# Altium project practice1.PrjPcb
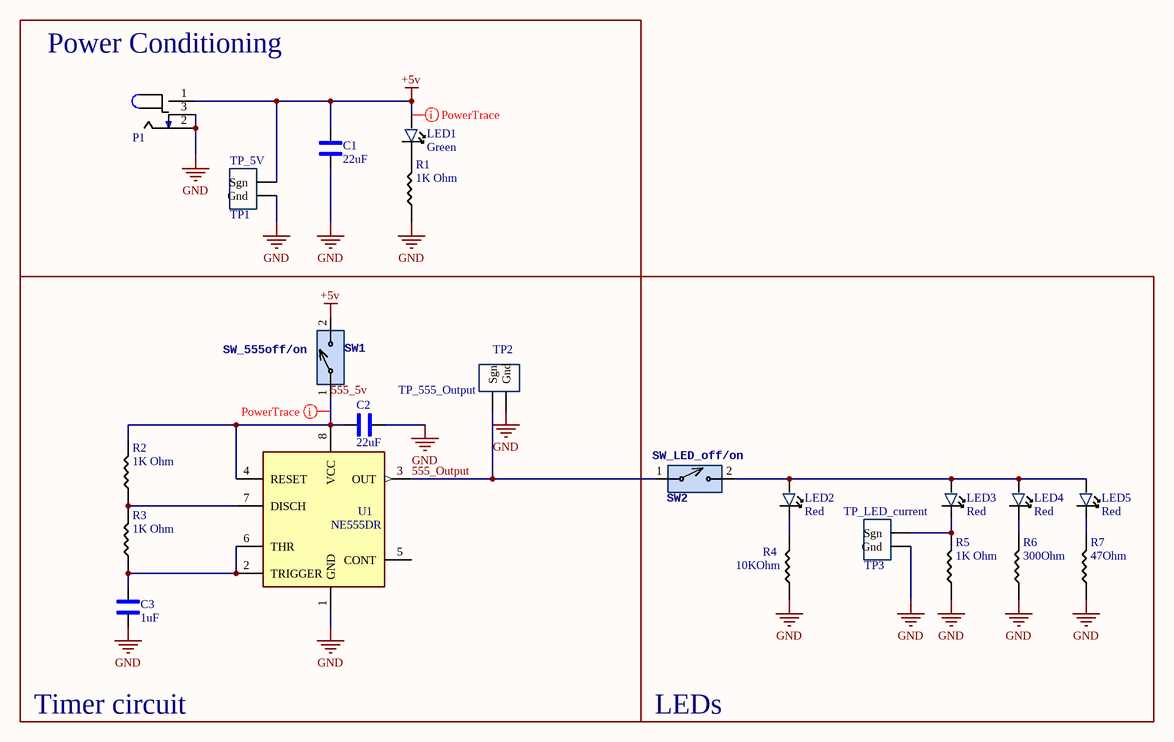
[diagram p0: Sheet1.SchDoc]
1 sheet, 22 parts. Net scope: global (net labels, ports and power ports of the same name join across sheets).
Board file: ECEN5730_brd1a_2022-15-01.PcbDoc

## Sheet Sheet1.SchDoc: Practice Board
size A4; DrawnBy: Rajat Chaple; Revision: 0.0.1; SheetNumber: 1; SheetTotal: 1

### Parts
C1  22uF  [1206_Passive_Capacitor]
C2  22uF  [1206_Passive_Capacitor]
C3  1uF  [1206_Passive_Capacitor]
LED1  value Green  [LED_0603]  (hidden comment: KT-0603R)
LED2  Red  [LED_1206]
LED3  Red  [LED_1206]
LED4  Red  [LED_1206]
LED5  Red  [LED_1206]
P1  Power Jack  [Power_Jack]  (value not drawn)
R1  value 1K Ohm  [0805_Passive_Resistor]  (hidden comment: 1k)
R2  value 1K Ohm  [0805_Passive_Resistor]  (hidden comment: 1k)
R3  value 1K Ohm  [0805_Passive_Resistor]  (hidden comment: 1k)
R4  value 10KOhm  [1206_Passive_Resitor]  (hidden comment: 10k)
R5  value 1K Ohm  [0805_Passive_Resistor]  (hidden comment: 1k)
R6  value 300Ohm  [1206_Passive_Resitor]  (hidden comment: 300)
R7  value 47Ohm  [1206_Passive_Resitor]  (hidden comment: 47 Ohms)
SW1  SW_555off/on  [2Pin-Header-Conn]
SW2  SW_LED_off/on  [2Pin-Header-Conn]
TP1  TP_5V  [TP10x_Probe]
TP2  TP_555_Output  [TP10x_Probe]
TP3  TP_LED_current  [TP10x_Probe]
U1  NE555DR  [TS555IDTTR]

### Blocks framed on the sheet
Power Conditioning: C1 LED1 P1 R1 TP1
Timer circuit: C2 C3 R2 R3 SW1 TP2 U1
LEDs: LED2-LED5 R4-R7 SW2 TP3

### Nets
+5v: C1.2 LED1.1 P1.1 SW1.2 TP1.1(Sgn)
GND: C1.1 C2.1 C3.1 P1.2 P1.3 R1.1 R4.1 R5.1 R6.1 R7.1 TP1.2(Gnd) TP2.2(Gnd) TP3.2(Gnd) U1.1(GND)
555_5v: C2.2 R2.2 SW1.1 U1.4(RESET) U1.8(VCC)
555_Output: SW2.1 TP2.1(Sgn) U1.3(OUT)
NetC3_2: C3.2 R3.1 U1.2(TRIGGER) U1.6(THR)
NetLED1_2: LED1.2 R1.2
NetLED2_1: LED2.1 LED3.1 LED4.1 LED5.1 SW2.2
NetLED2_2: LED2.2 R4.2
NetLED3_2: LED3.2 R5.2 TP3.1(Sgn)
NetLED4_2: LED4.2 R6.2
NetLED5_2: LED5.2 R7.2
NetR2_1: R2.1 R3.2 U1.7(DISCH)

Not connected (* = marked no-connect by the designer): U1 5(CONT)

### Layout directives
rule Width Constraint [Pref Width = 20mil    Min Width = 10mil    Max Width = 100mil]: 555_5v, +5v

### Library data of the parts
C1 C2 = C_22uF_1206: 22uF ±10% 25V X5R 1206 Multilayer Ceramic Capacitors MLCC - SMD/SMT RoHS; MFR Part #: CL31A226KAHNNNE; Type: Extended; LCSC Part#: C12891; Datasheet: https://datasheet.lcsc.com/lcsc/1811031514_Samsung-Electro-Mechanics-CL31A226KAHNNNE_C12891.pdf; Value: 22uF
C3 = C_1uF_1206: MULTILAYER CERAMIC CAPACITORS MLCC - SMD/SMT 1UF 50V 1206 ROHS; MFR Part #: CL31B105KBHNNNE; Type: Basic; Digikey Link: https://www.digikey.com/product-detail/en/C1206C105M4RACTU/399-8150-1-ND/3471873/?itemSeq=304982366; Digikey Part: 399-8150-1-ND; LCSC Part#: C1848; Value: 1uF
LED1 = LED_GREEN_0603: LIGHT EMITTING DIODES (LED) GREEN 520~535NM 112~258MCD@20MA TOP VIEW 0603 ROHS; MFR Part #: 19-217/GHC-YR1S2/3T; Type: Basic; LCSC Part#: C72043
LED2-LED5 = LED_RED_1206: Red 621~631nm 1206 Light Emitting Diodes (LED) RoHS; MFR Part #: 15-21/R6C-FQ1R1B/2T; Type: Extended; LCSC Part#: C93133; Datasheet: https://datasheet.lcsc.com/szlcsc/1811151241_Everlight-Elec-15-21-R6C-FQ1R1B-2T_C93133.pdf; Value: Red
P1 = P_Power Jack: Power Barrel Connector Jack 2.10mm ID (0.083"), 5.50mm OD (0.217") Through Hole, Right Angle; Value: CONN PWR JACK 2X5.5MM SOLDER; Digikey Link: https://www.digikey.com/product-detail/en/PJ-102A/CP-102A-ND/275425/?itemSeq=304982367; Digikey Part: CP-102A-ND; LCSC Part#: C136744; Type: Extended
R1-R3 R5 = R_1K_0805: CHIP RESISTOR - SURFACE MOUNT 1KOHMS ±1% 1/8W 0805 ROHS; MFR Part #: 0805W8F1001T5E; LCSC Part#: C17513; Type: Basic
R4 = R_10KOhm_1206: 10 kOhms ±5% 0.25W, 1/4W Chip Resistor 1206 (3216 Metric) Automotive AEC-Q200 Thick Film; Digikey Link: https://www.digikey.com/product-detail/en/RMCF1206JT300R/RMCF1206JT300RCT-ND/1942776/?itemSeq=304982374; Digikey Part: RMCF1206JT300RCT-ND; LCSC Part#: C17902; Type: Basic
R6 = R_300Ohm_1206: CHIP RESISTOR - SURFACE MOUNT 300OHMS ±1% 1/4W 1206 ROHS; MFR Part #: 1206W4F3000T5E; Datasheet: https://datasheet.lcsc.com/szlcsc/Uniroyal-Elec-1206W4F3000T5E_C17887.pdf; LCSC Part#: C17887; Type: Basic
R7 = R_47Ohm_1206: 47Ω ±5% 0.25W ±200ppm/℃ 1206 Chip Resistor - Surface Mount RoHS; MFR Part #: 1206W4J0470T5E; LCSC Part#: C25384; Type: Extended; Datasheet: https://datasheet.lcsc.com/lcsc/1811101020_UNI-ROYAL-Uniroyal-Elec-1206W4J0470T5E_C25384.pdf
SW1 SW2 = SW_2Pin_100mil_Switch: 2Pin Header; LCSC Part#: C124375; Type: Extended
TP1-TP3 = TP_10x_Probe: Test Point 300 mil centers
U1 = U_555_Slow: 555 Timer SOIC-8_150MIL ROHS 150ns Rise Time; MFR Part #: NE555DR; Digikey Link: https://www.digikey.com/product-detail/en/texas-instruments/NE555DR/296-6501-1-ND/372490; Type: Basic; LCSC Part#: C7593